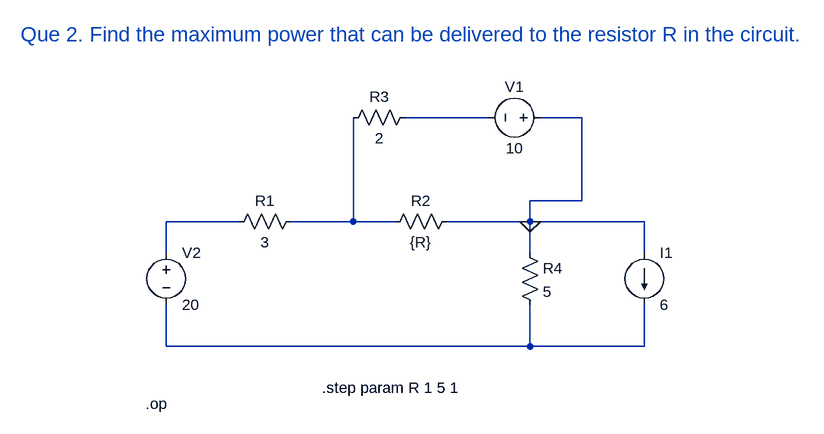
[diagram p0: schematic 2_Dheerendra_23EE019_Power_Transfer.asc]
2_Dheerendra_23EE019_Power_Transfer.asc, the LTspice schematic file:
Version 4
SHEET 1 992 680
WIRE 400 -16 272 -16
WIRE 544 -16 480 -16
WIRE 544 112 544 -16
WIRE 544 112 464 112
WIRE 16 144 -96 144
WIRE 192 144 192 -16
WIRE 192 144 96 144
WIRE 256 144 192 144
WIRE 464 144 464 112
WIRE 464 144 336 144
WIRE 640 144 464 144
WIRE -96 192 -96 144
WIRE 464 192 464 144
WIRE 640 192 640 144
WIRE -96 336 -96 272
WIRE 464 336 464 272
WIRE 464 336 -96 336
WIRE 640 336 640 272
WIRE 640 336 464 336
FLAG 464 144 0
SYMBOL res 112 128 R90
WINDOW 0 0 56 VBottom 2
WINDOW 3 32 56 VTop 2
SYMATTR InstName R1
SYMATTR Value 3
SYMBOL res 352 128 R90
WINDOW 0 0 56 VBottom 2
WINDOW 3 32 56 VTop 2
SYMATTR InstName R2
SYMATTR Value {R}
SYMBOL res 288 -32 R90
WINDOW 0 0 56 VBottom 2
WINDOW 3 32 56 VTop 2
SYMATTR InstName R3
SYMATTR Value 2
SYMBOL voltage 496 -16 R90
WINDOW 0 -32 56 VBottom 2
WINDOW 3 32 56 VTop 2
WINDOW 123 0 0 Left 0
WINDOW 39 0 0 Left 0
SYMATTR InstName V1
SYMATTR Value 10
SYMBOL res 448 176 R0
SYMATTR InstName R4
SYMATTR Value 5
SYMBOL voltage -96 176 R0
WINDOW 123 0 0 Left 0
WINDOW 39 0 0 Left 0
SYMATTR InstName V2
SYMATTR Value 20
SYMBOL current 640 192 R0
WINDOW 123 0 0 Left 0
WINDOW 39 0 0 Left 0
SYMATTR InstName I1
SYMATTR Value 6
TEXT 144 400 Left 2 !.step param R 1 5 1
TEXT -128 424 Left 2 !.op
TEXT -320 -144 Left 3 ;Que 2. Find the maximum power that can be delivered to the resistor R in the circuit.

The netlist it stands for:
* 2_Dheerendra_23EE019_Power_Transfer.asc
R1 N003 N002 3
R2 0 N003 {R}
R3 N001 N003 2
V1 0 N001 10
R4 0 N004 5
V2 N002 N004 20
I1 0 N004 6
.step param R 1 5 1
.op
* Que 2. Find the maximum power that can be delivered to the resistor R in the circuit.
.backanno
.end